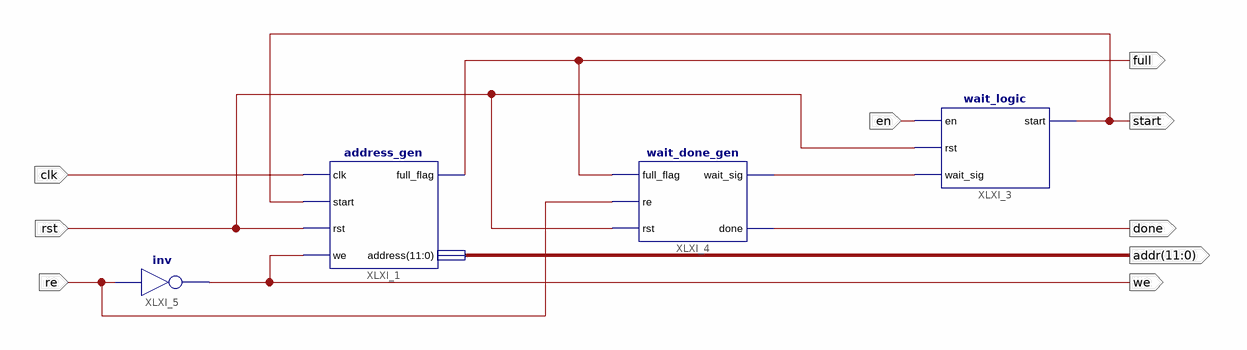
[diagram p0: schematic sheet 1]
// Xilinx ISE schematic mem_control.sch (spartan3a) as structural Verilog: 4 symbols, 9 ports
module mem_control (
  input  en,
  input  clk,
  input  rst,
  input  re,
  output full,
  output we,
  output [11:0] addr,
  output done,
  output start
);

  wire XLXN_2;

  address_gen XLXI_1 (.clk(clk), .start(start), .rst(rst), .we(we), .full_flag(full), .address(addr));
  wait_logic XLXI_3 (.en(en), .rst(rst), .wait_sig(XLXN_2), .start(start));
  wait_done_gen XLXI_4 (.full_flag(full), .re(re), .rst(rst), .wait_sig(XLXN_2), .done(done));
  not XLXI_5 (we, re);
endmodule
